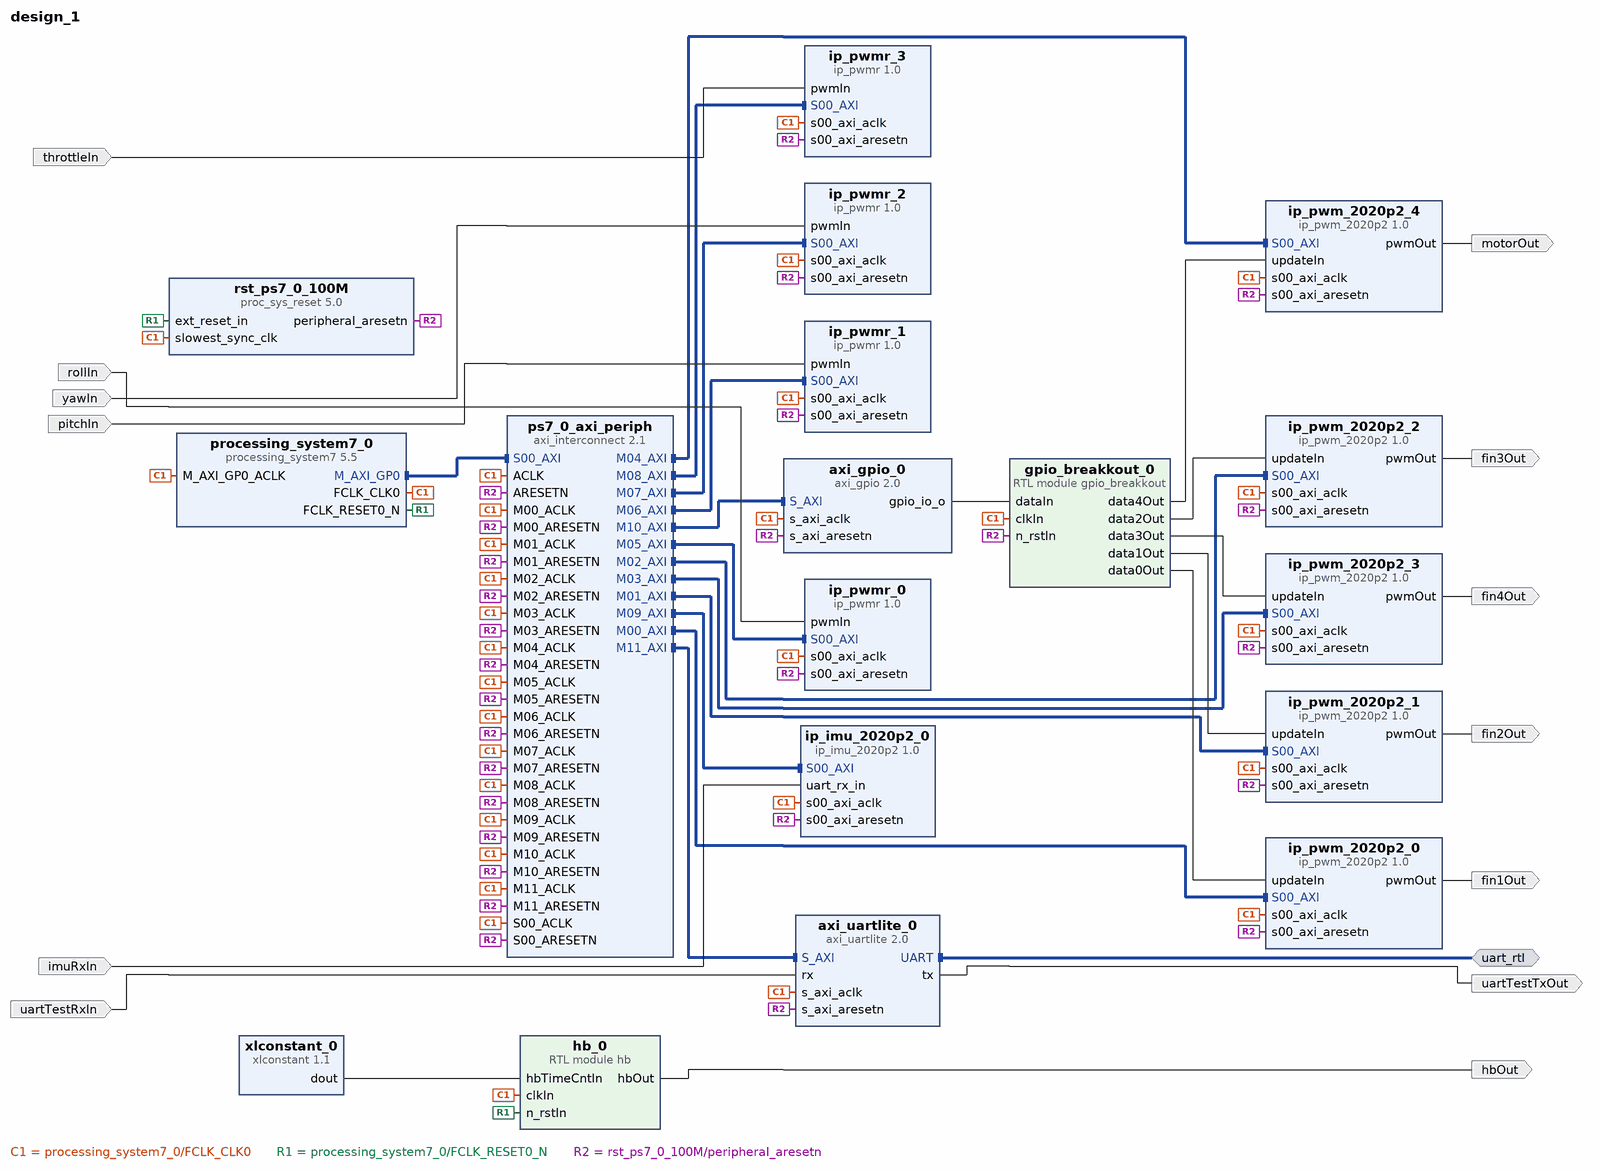
[diagram p0: block diagram of the top level]
# Vivado block design design_1, xc7z010clg400-1, Vivado 2020.2
create_bd_design design_1

create_bd_intf_port -mode Master -vlnv xilinx.com:interface:uart_rtl:1.0 uart_rtl
create_bd_port -dir O hbOut
create_bd_port -dir O fin1Out
create_bd_port -dir O fin2Out
create_bd_port -dir O fin3Out
create_bd_port -dir O fin4Out
create_bd_port -dir O motorOut
create_bd_port -dir I rollIn
create_bd_port -dir I pitchIn
create_bd_port -dir I yawIn
create_bd_port -dir I throttleIn
create_bd_port -dir I imuRxIn
create_bd_port -dir O uartTestTxOut
create_bd_port -dir I uartTestRxIn

create_bd_cell -type ip -vlnv xilinx.com:ip:processing_system7:5.5 processing_system7_0
set_property -dict [list \
  CONFIG.PCW_CRYSTAL_PERIPHERAL_FREQMHZ 50 \
  CONFIG.PCW_FPGA0_PERIPHERAL_FREQMHZ 100 \
  CONFIG.PCW_UART1_PERIPHERAL_ENABLE 1 \
  CONFIG.PCW_UART1_UART1_IO {MIO 48 .. 49} \
  CONFIG.PCW_UART_PERIPHERAL_FREQMHZ 100 \
] [get_bd_cells processing_system7_0]
# 41 more settings of processing_system7_0 are not shown: defaults, MIO pin electricals, DDR timing, and values the tool derives
create_bd_cell -type module -reference hb hb_0
create_bd_cell -type ip -vlnv xilinx.com:ip:xlconstant:1.1 xlconstant_0
set_property -dict {CONFIG.CONST_VAL 100000000 CONFIG.CONST_WIDTH 32} [get_bd_cells xlconstant_0]
create_bd_cell -type ip -vlnv xilinx.com:ip:axi_interconnect:2.1 ps7_0_axi_periph
set_property -dict {CONFIG.NUM_MI 12} [get_bd_cells ps7_0_axi_periph]
create_bd_cell -type ip -vlnv xilinx.com:ip:proc_sys_reset:5.0 rst_ps7_0_100M
create_bd_cell -type ip -vlnv xilinx.com:user:ip_pwmr:1.0 ip_pwmr_0
set_property -dict {CONFIG.SAMPLING_COUNT 0} [get_bd_cells ip_pwmr_0]
create_bd_cell -type ip -vlnv xilinx.com:user:ip_pwmr:1.0 ip_pwmr_1
set_property -dict {CONFIG.SAMPLING_COUNT 0} [get_bd_cells ip_pwmr_1]
create_bd_cell -type ip -vlnv xilinx.com:user:ip_pwmr:1.0 ip_pwmr_2
set_property -dict {CONFIG.SAMPLING_COUNT 0} [get_bd_cells ip_pwmr_2]
create_bd_cell -type ip -vlnv xilinx.com:user:ip_pwmr:1.0 ip_pwmr_3
set_property -dict {CONFIG.SAMPLING_COUNT 0} [get_bd_cells ip_pwmr_3]
create_bd_cell -type ip -vlnv xilinx.com:ip:axi_gpio:2.0 axi_gpio_0
set_property -dict [list \
  CONFIG.C_ALL_INPUTS 0 \
  CONFIG.C_ALL_OUTPUTS 1 \
  CONFIG.C_GPIO_WIDTH 5 \
  CONFIG.GPIO_BOARD_INTERFACE Custom \
  CONFIG.USE_BOARD_FLOW true \
] [get_bd_cells axi_gpio_0]
create_bd_cell -type module -reference gpio_breakkout gpio_breakkout_0
create_bd_cell -type ip -vlnv xilinx.com:ip:axi_uartlite:2.0 axi_uartlite_0
set_property -dict {CONFIG.C_BAUDRATE 115200} [get_bd_cells axi_uartlite_0]
create_bd_cell -type ip -vlnv xilinx.com:user:ip_imu_2020p2:1.0 ip_imu_2020p2_0
create_bd_cell -type ip -vlnv user.org:user:ip_pwm_2020p2:1.0 ip_pwm_2020p2_0
create_bd_cell -type ip -vlnv user.org:user:ip_pwm_2020p2:1.0 ip_pwm_2020p2_1
create_bd_cell -type ip -vlnv user.org:user:ip_pwm_2020p2:1.0 ip_pwm_2020p2_2
create_bd_cell -type ip -vlnv user.org:user:ip_pwm_2020p2:1.0 ip_pwm_2020p2_3
create_bd_cell -type ip -vlnv user.org:user:ip_pwm_2020p2:1.0 ip_pwm_2020p2_4

# ---- connections ----

connect_bd_intf_net [get_bd_intf_pins ps7_0_axi_periph/M05_AXI] [get_bd_intf_pins ip_pwmr_0/S00_AXI]
connect_bd_intf_net [get_bd_intf_pins ps7_0_axi_periph/M11_AXI] [get_bd_intf_pins axi_uartlite_0/S_AXI]
connect_bd_intf_net [get_bd_intf_pins processing_system7_0/M_AXI_GP0] [get_bd_intf_pins ps7_0_axi_periph/S00_AXI]
connect_bd_intf_net [get_bd_intf_pins ps7_0_axi_periph/M06_AXI] [get_bd_intf_pins ip_pwmr_1/S00_AXI]
connect_bd_intf_net [get_bd_intf_pins ps7_0_axi_periph/M02_AXI] [get_bd_intf_pins ip_pwm_2020p2_2/S00_AXI]
connect_bd_intf_net [get_bd_intf_pins ps7_0_axi_periph/M00_AXI] [get_bd_intf_pins ip_pwm_2020p2_0/S00_AXI]
connect_bd_intf_net [get_bd_intf_ports uart_rtl] [get_bd_intf_pins axi_uartlite_0/UART]
connect_bd_intf_net [get_bd_intf_pins ps7_0_axi_periph/M10_AXI] [get_bd_intf_pins axi_gpio_0/S_AXI]
connect_bd_intf_net [get_bd_intf_pins ps7_0_axi_periph/M04_AXI] [get_bd_intf_pins ip_pwm_2020p2_4/S00_AXI]
connect_bd_intf_net [get_bd_intf_pins ps7_0_axi_periph/M09_AXI] [get_bd_intf_pins ip_imu_2020p2_0/S00_AXI]
connect_bd_intf_net [get_bd_intf_pins ps7_0_axi_periph/M01_AXI] [get_bd_intf_pins ip_pwm_2020p2_1/S00_AXI]
connect_bd_intf_net [get_bd_intf_pins ps7_0_axi_periph/M03_AXI] [get_bd_intf_pins ip_pwm_2020p2_3/S00_AXI]
connect_bd_intf_net [get_bd_intf_pins ps7_0_axi_periph/M07_AXI] [get_bd_intf_pins ip_pwmr_2/S00_AXI]
connect_bd_intf_net [get_bd_intf_pins ps7_0_axi_periph/M08_AXI] [get_bd_intf_pins ip_pwmr_3/S00_AXI]
connect_bd_net [get_bd_pins processing_system7_0/FCLK_CLK0] \
  [get_bd_pins hb_0/clkIn] [get_bd_pins processing_system7_0/M_AXI_GP0_ACLK] [get_bd_pins ps7_0_axi_periph/S00_ACLK] \
  [get_bd_pins rst_ps7_0_100M/slowest_sync_clk] [get_bd_pins ps7_0_axi_periph/M00_ACLK] [get_bd_pins ps7_0_axi_periph/ACLK] \
  [get_bd_pins ps7_0_axi_periph/M01_ACLK] [get_bd_pins ps7_0_axi_periph/M02_ACLK] [get_bd_pins ps7_0_axi_periph/M03_ACLK] \
  [get_bd_pins ps7_0_axi_periph/M04_ACLK] [get_bd_pins ps7_0_axi_periph/M05_ACLK] [get_bd_pins ps7_0_axi_periph/M06_ACLK] \
  [get_bd_pins ps7_0_axi_periph/M07_ACLK] [get_bd_pins ps7_0_axi_periph/M08_ACLK] [get_bd_pins ps7_0_axi_periph/M09_ACLK] \
  [get_bd_pins ip_pwmr_0/s00_axi_aclk] [get_bd_pins ip_pwmr_1/s00_axi_aclk] [get_bd_pins ip_pwmr_2/s00_axi_aclk] \
  [get_bd_pins ip_pwmr_3/s00_axi_aclk] [get_bd_pins axi_gpio_0/s_axi_aclk] [get_bd_pins ps7_0_axi_periph/M10_ACLK] \
  [get_bd_pins gpio_breakkout_0/clkIn] [get_bd_pins axi_uartlite_0/s_axi_aclk] [get_bd_pins ps7_0_axi_periph/M11_ACLK] \
  [get_bd_pins ip_imu_2020p2_0/s00_axi_aclk] [get_bd_pins ip_pwm_2020p2_0/s00_axi_aclk] \
  [get_bd_pins ip_pwm_2020p2_1/s00_axi_aclk] [get_bd_pins ip_pwm_2020p2_2/s00_axi_aclk] \
  [get_bd_pins ip_pwm_2020p2_3/s00_axi_aclk] [get_bd_pins ip_pwm_2020p2_4/s00_axi_aclk]
connect_bd_net [get_bd_pins processing_system7_0/FCLK_RESET0_N] [get_bd_pins hb_0/n_rstIn] [get_bd_pins rst_ps7_0_100M/ext_reset_in]
connect_bd_net [get_bd_pins hb_0/hbOut] [get_bd_ports hbOut]
connect_bd_net [get_bd_pins xlconstant_0/dout] [get_bd_pins hb_0/hbTimeCntIn]
connect_bd_net [get_bd_pins ip_pwm_2020p2_0/pwmOut] [get_bd_ports fin1Out]
connect_bd_net [get_bd_pins ip_pwm_2020p2_1/pwmOut] [get_bd_ports fin2Out]
connect_bd_net [get_bd_pins ip_pwm_2020p2_2/pwmOut] [get_bd_ports fin3Out]
connect_bd_net [get_bd_pins ip_pwm_2020p2_3/pwmOut] [get_bd_ports fin4Out]
connect_bd_net [get_bd_pins ip_pwm_2020p2_4/pwmOut] [get_bd_ports motorOut]
connect_bd_net [get_bd_pins rst_ps7_0_100M/peripheral_aresetn] \
  [get_bd_pins ps7_0_axi_periph/S00_ARESETN] [get_bd_pins ps7_0_axi_periph/M00_ARESETN] \
  [get_bd_pins ps7_0_axi_periph/ARESETN] [get_bd_pins ps7_0_axi_periph/M01_ARESETN] \
  [get_bd_pins ps7_0_axi_periph/M02_ARESETN] [get_bd_pins ps7_0_axi_periph/M03_ARESETN] \
  [get_bd_pins ps7_0_axi_periph/M04_ARESETN] [get_bd_pins ps7_0_axi_periph/M05_ARESETN] \
  [get_bd_pins ps7_0_axi_periph/M06_ARESETN] [get_bd_pins ps7_0_axi_periph/M07_ARESETN] \
  [get_bd_pins ps7_0_axi_periph/M08_ARESETN] [get_bd_pins ps7_0_axi_periph/M09_ARESETN] \
  [get_bd_pins ip_pwmr_0/s00_axi_aresetn] [get_bd_pins ip_pwmr_1/s00_axi_aresetn] [get_bd_pins ip_pwmr_2/s00_axi_aresetn] \
  [get_bd_pins ip_pwmr_3/s00_axi_aresetn] [get_bd_pins axi_gpio_0/s_axi_aresetn] [get_bd_pins ps7_0_axi_periph/M10_ARESETN] \
  [get_bd_pins gpio_breakkout_0/n_rstIn] [get_bd_pins axi_uartlite_0/s_axi_aresetn] \
  [get_bd_pins ps7_0_axi_periph/M11_ARESETN] [get_bd_pins ip_imu_2020p2_0/s00_axi_aresetn] \
  [get_bd_pins ip_pwm_2020p2_0/s00_axi_aresetn] [get_bd_pins ip_pwm_2020p2_1/s00_axi_aresetn] \
  [get_bd_pins ip_pwm_2020p2_2/s00_axi_aresetn] [get_bd_pins ip_pwm_2020p2_3/s00_axi_aresetn] \
  [get_bd_pins ip_pwm_2020p2_4/s00_axi_aresetn]
connect_bd_net [get_bd_ports rollIn] [get_bd_pins ip_pwmr_0/pwmIn]
connect_bd_net [get_bd_ports pitchIn] [get_bd_pins ip_pwmr_1/pwmIn]
connect_bd_net [get_bd_ports yawIn] [get_bd_pins ip_pwmr_2/pwmIn]
connect_bd_net [get_bd_ports throttleIn] [get_bd_pins ip_pwmr_3/pwmIn]
connect_bd_net [get_bd_ports imuRxIn] [get_bd_pins ip_imu_2020p2_0/uart_rx_in]
connect_bd_net [get_bd_pins axi_gpio_0/gpio_io_o] [get_bd_pins gpio_breakkout_0/dataIn]
connect_bd_net [get_bd_pins gpio_breakkout_0/data0Out] [get_bd_pins ip_pwm_2020p2_0/updateIn]
connect_bd_net [get_bd_pins gpio_breakkout_0/data1Out] [get_bd_pins ip_pwm_2020p2_1/updateIn]
connect_bd_net [get_bd_pins gpio_breakkout_0/data2Out] [get_bd_pins ip_pwm_2020p2_2/updateIn]
connect_bd_net [get_bd_pins gpio_breakkout_0/data3Out] [get_bd_pins ip_pwm_2020p2_3/updateIn]
connect_bd_net [get_bd_pins gpio_breakkout_0/data4Out] [get_bd_pins ip_pwm_2020p2_4/updateIn]
connect_bd_net [get_bd_pins axi_uartlite_0/tx] [get_bd_ports uartTestTxOut]
connect_bd_net -net uartRxIn_1 [get_bd_ports uartTestRxIn] [get_bd_pins axi_uartlite_0/rx]

# ---- address map ----
assign_bd_address -offset 0x41200000 -range 128 -target_address_space [get_bd_addr_spaces processing_system7_0/Data] [get_bd_addr_segs axi_gpio_0/S_AXI/Reg]
assign_bd_address -offset 0x42C00000 -range 64K -target_address_space [get_bd_addr_spaces processing_system7_0/Data] [get_bd_addr_segs axi_uartlite_0/S_AXI/Reg]
assign_bd_address -offset 0x43C00000 -range 128 -target_address_space [get_bd_addr_spaces processing_system7_0/Data] [get_bd_addr_segs ip_pwm_2020p2_0/S00_AXI/S00_AXI_reg]
assign_bd_address -offset 0x43C10000 -range 128 -target_address_space [get_bd_addr_spaces processing_system7_0/Data] [get_bd_addr_segs ip_pwm_2020p2_1/S00_AXI/S00_AXI_reg]
assign_bd_address -offset 0x43C20000 -range 128 -target_address_space [get_bd_addr_spaces processing_system7_0/Data] [get_bd_addr_segs ip_pwm_2020p2_2/S00_AXI/S00_AXI_reg]
assign_bd_address -offset 0x43C30000 -range 128 -target_address_space [get_bd_addr_spaces processing_system7_0/Data] [get_bd_addr_segs ip_pwm_2020p2_3/S00_AXI/S00_AXI_reg]
assign_bd_address -offset 0x43C40000 -range 128 -target_address_space [get_bd_addr_spaces processing_system7_0/Data] [get_bd_addr_segs ip_pwm_2020p2_4/S00_AXI/S00_AXI_reg]
assign_bd_address -offset 0x43C50000 -range 128 -target_address_space [get_bd_addr_spaces processing_system7_0/Data] [get_bd_addr_segs ip_pwmr_0/S00_AXI/S00_AXI_reg]
assign_bd_address -offset 0x43C60000 -range 128 -target_address_space [get_bd_addr_spaces processing_system7_0/Data] [get_bd_addr_segs ip_pwmr_1/S00_AXI/S00_AXI_reg]
assign_bd_address -offset 0x43C70000 -range 128 -target_address_space [get_bd_addr_spaces processing_system7_0/Data] [get_bd_addr_segs ip_pwmr_2/S00_AXI/S00_AXI_reg]
assign_bd_address -offset 0x43C80000 -range 128 -target_address_space [get_bd_addr_spaces processing_system7_0/Data] [get_bd_addr_segs ip_pwmr_3/S00_AXI/S00_AXI_reg]
assign_bd_address -offset 0x43C90000 -range 1K -target_address_space [get_bd_addr_spaces processing_system7_0/Data] [get_bd_addr_segs ip_imu_2020p2_0/S00_AXI/S00_AXI_reg]

validate_bd_design
save_bd_design
